# EAGLE design Arduino_8FSR (EAGLE 9.5.2)
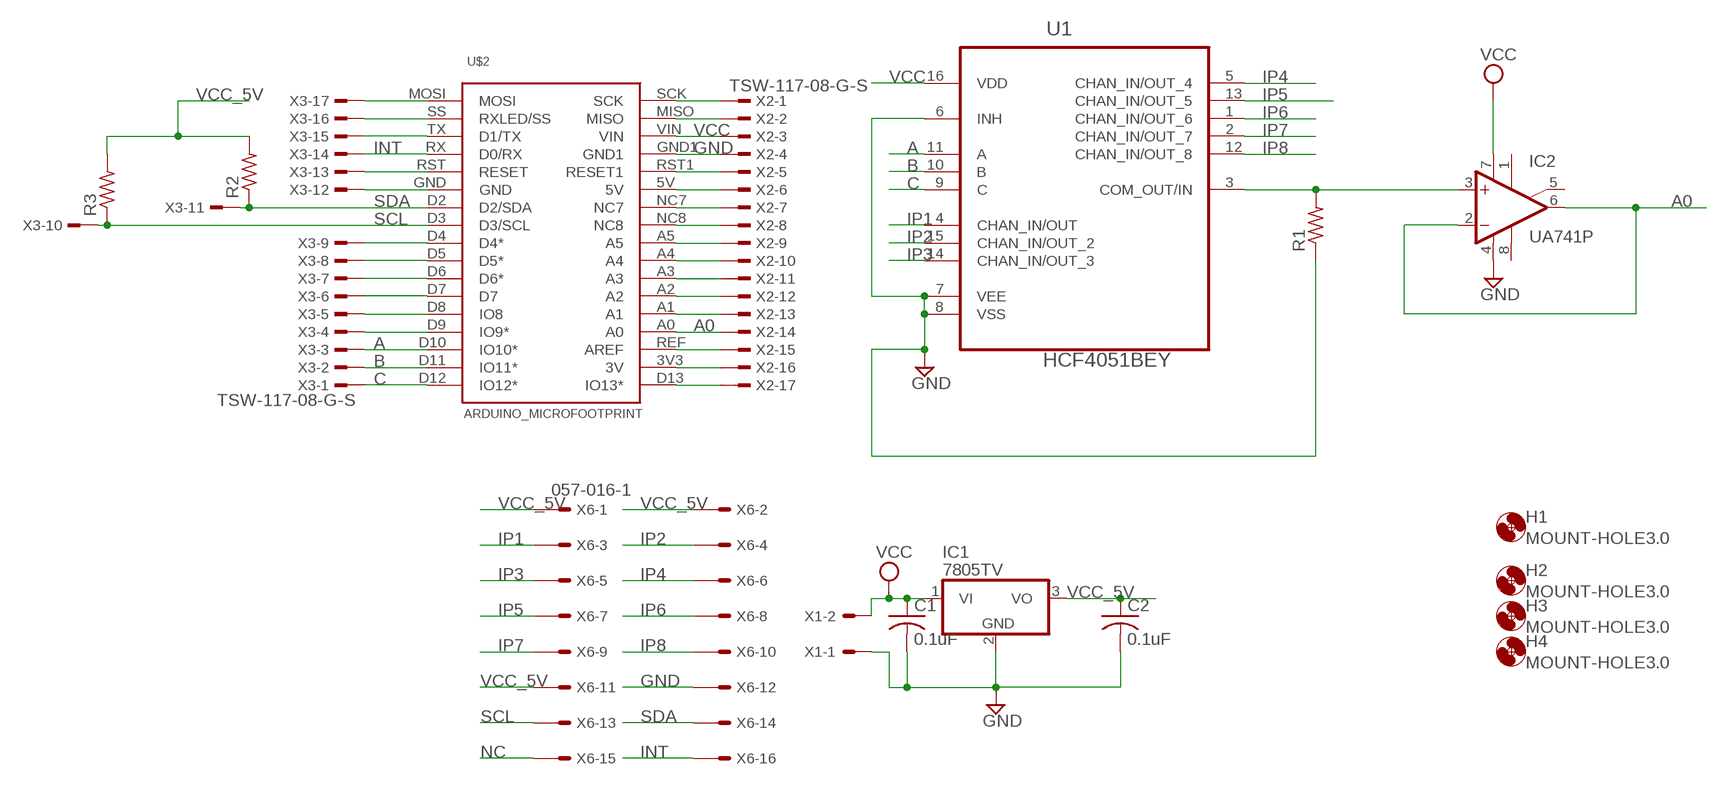
[diagram p0: schematic, sheet 1]

## Parts
C1  0.1uF  C-US025-024X044  [C025-024X044]
C2  0.1uF  C-US025-024X044  [C025-024X044]
H1  MOUNT-HOLE3.0  [3,0]
H2  MOUNT-HOLE3.0  [3,0]
H3  MOUNT-HOLE3.0  [3,0]
H4  MOUNT-HOLE3.0  [3,0]
IC1  7805TV  [TO220V]
IC2  UA741P  [DIL08]
R1  R-US_0204/7  [0204/7]
R2  R-US_0204/7  [0204/7]
R3  R-US_0204/7  [0204/7]
U1  HCF4051BEY  [DIP254P762X510-16]
U$2  ARDUINO_MICROFOOTPRINT  [ARDUINO-MICRO]
X1  KK-156-2  [KK-156-2]
X2  TSW-117-08-G-S  [TSW-117-XX-G-S]
X3  TSW-117-08-G-S  [TSW-117-XX-G-S]
X6  057-016-1  [057-016-1]

## Nets
A: U1.11(A) U$2.D10(IO10*) X3.3
A0: IC2.2(-IN) IC2.6(OUT) U$2.A0 X2.14
B: U1.10(B) U$2.D11(IO11*) X3.2
C: U1.9(C) U$2.D12(IO12*) X3.1
GND: C1.2 C2.2 IC1.2(GND) IC2.4(V-) R1.1 U1.6(INH) U1.7(VEE) U1.8(VSS) U$2.GND1 X1.1 X2.4 X6.12
INT: U$2.RX(D0/RX) X3.14 X6.16
IP1: U1.4(CHAN_IN/OUT) X6.3
IP2: U1.15(CHAN_IN/OUT_2) X6.4
IP3: U1.14(CHAN_IN/OUT_3) X6.5
IP4: U1.5(CHAN_IN/OUT_4) X6.6
IP5: U1.13(CHAN_IN/OUT_5) X6.7
IP6: U1.1(CHAN_IN/OUT_6) X6.8
IP7: U1.2(CHAN_IN/OUT_7) X6.9
IP8: U1.12(CHAN_IN/OUT_8) X6.10
N$1: U$2.MOSI X3.17
N$2: U$2.SS(RXLED/SS) X3.16
N$3: U$2.D13(IO13*) X2.17
N$4: U$2.D5(D5*) X3.8
N$5: U$2.RST(RESET) X3.13
N$6: U$2.GND X3.12
N$7: U$2.D6(D6*) X3.7
N$8: U$2.D7 X3.6
N$9: U$2.D4(D4*) X3.9
N$10: U$2.TX(D1/TX) X3.15
N$13: U$2.D8(IO8) X3.5
N$14: U$2.D9(IO9*) X3.4
N$19: U$2.3V3(3V) X2.16
N$20: U$2.REF(AREF) X2.15
N$22: U$2.A1 X2.13
N$23: U$2.A2 X2.12
N$24: U$2.A3 X2.11
N$25: U$2.A4 X2.10
N$26: U$2.A5 X2.9
N$27: U$2.NC8 X2.8
N$28: U$2.NC7 X2.7
N$29: U$2.5V X2.6
N$30: U$2.RST1(RESET1) X2.5
N$33: U$2.MISO X2.2
N$34: U$2.SCK X2.1
N$48: IC2.3(+IN) R1.2 U1.3(COM_OUT/IN)
NC: X6.15
SCL: R3.1 U$2.D3(D3/SCL) X3.10 X6.13
SDA: R2.1 U$2.D2(D2/SDA) X3.11 X6.14
VCC: C1.1 IC1.1(VI) IC2.7(V+) U1.16(VDD) U$2.VIN X1.2 X2.3
VCC_5V: C2.1 IC1.3(VO) R2.2 R3.2 X6.1 X6.2 X6.11
Unconnected: IC2.1(ON1) IC2.5(ON2) IC2.8(OPT)

## Library data of the parts
C1 C2 = rcl:C-US: CAPACITOR, American symbol; SPICEPREFIX: C
H1-H4 = holes:MOUNT-HOLE: MOUNTING HOLE with drill center marker
IC1 = linear:78*: Positive VOLTAGE REGULATOR Source: http://cache.national.com/ds/LM/LM78L05.pdf http://www.fairchildsemi.com/ds/LM/LM7805.pdf
IC2 = linear:*741: OP AMP
R1-R3 = rcl:R-US_: RESISTOR, American symbol; SPICEPREFIX: R
U1 = HCF4051BEY:HCF4051BEY: ANALOG MULTIPLEXER/DEMULTIPLEXER; AVAILABILITY: Unavailable; DESCRIPTION: 1 Circuit IC Switch 8:1 280Ohm 16-PDIP; MF: STMicroelectronics; MP: HCF4051BEY; PACKAGE: DIP-16 STMicroelectronics; PRICE: None
U$2 = arduino-micro:ARDUINO_MICRO
X1 = con-molex:KK-156-2: KK 156 HEADER Source: http://www.molex.com/pdm_docs/sd/026604100_sd.pdf; MF: MOLEX; OC_FARNELL: unknown; OC_NEWARK: unknown
X2 X3 = con-samtec:TSW-117-*-G-S: THROUGH-HOLE .025" SQ POST HEADER Source: Samtec TSW.pdf; MF: Samtec Inc.; MPN: TSW-117-07-G-S
X6 = con-panduit:057-016-: CONNECTOR 10-pin series 057 contact pc board low profile headers; OC_FARNELL: unknown; OC_NEWARK: unknown

## Board
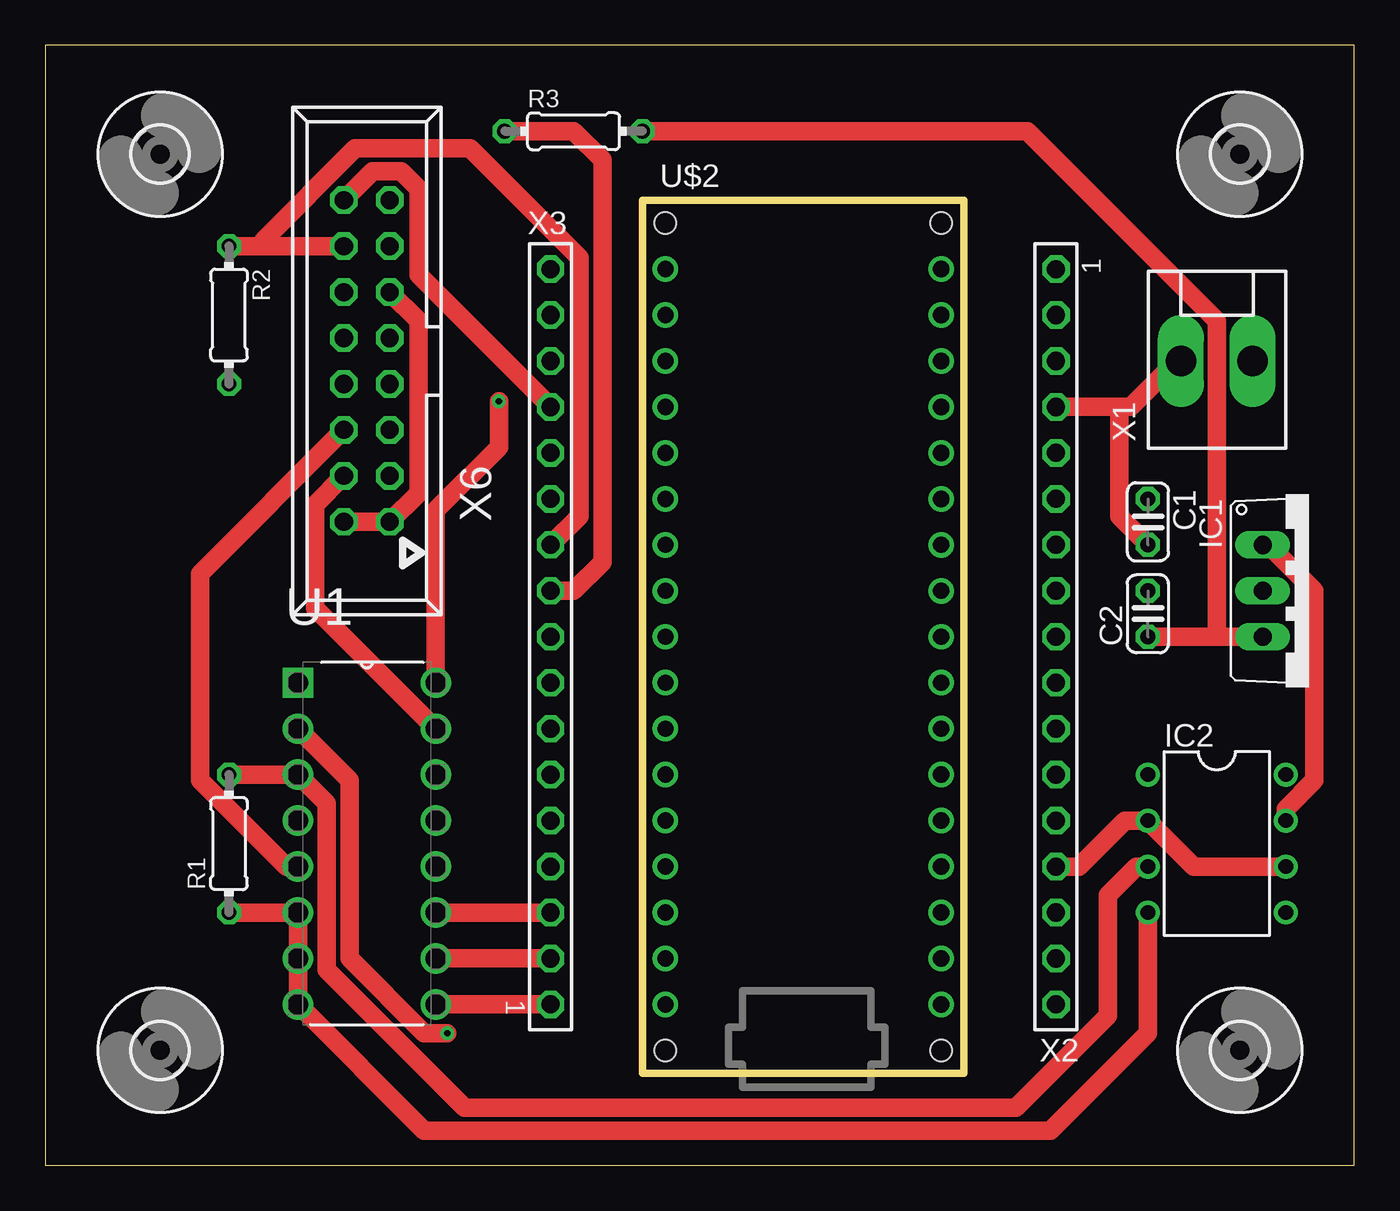
[diagram p1: board, top side]
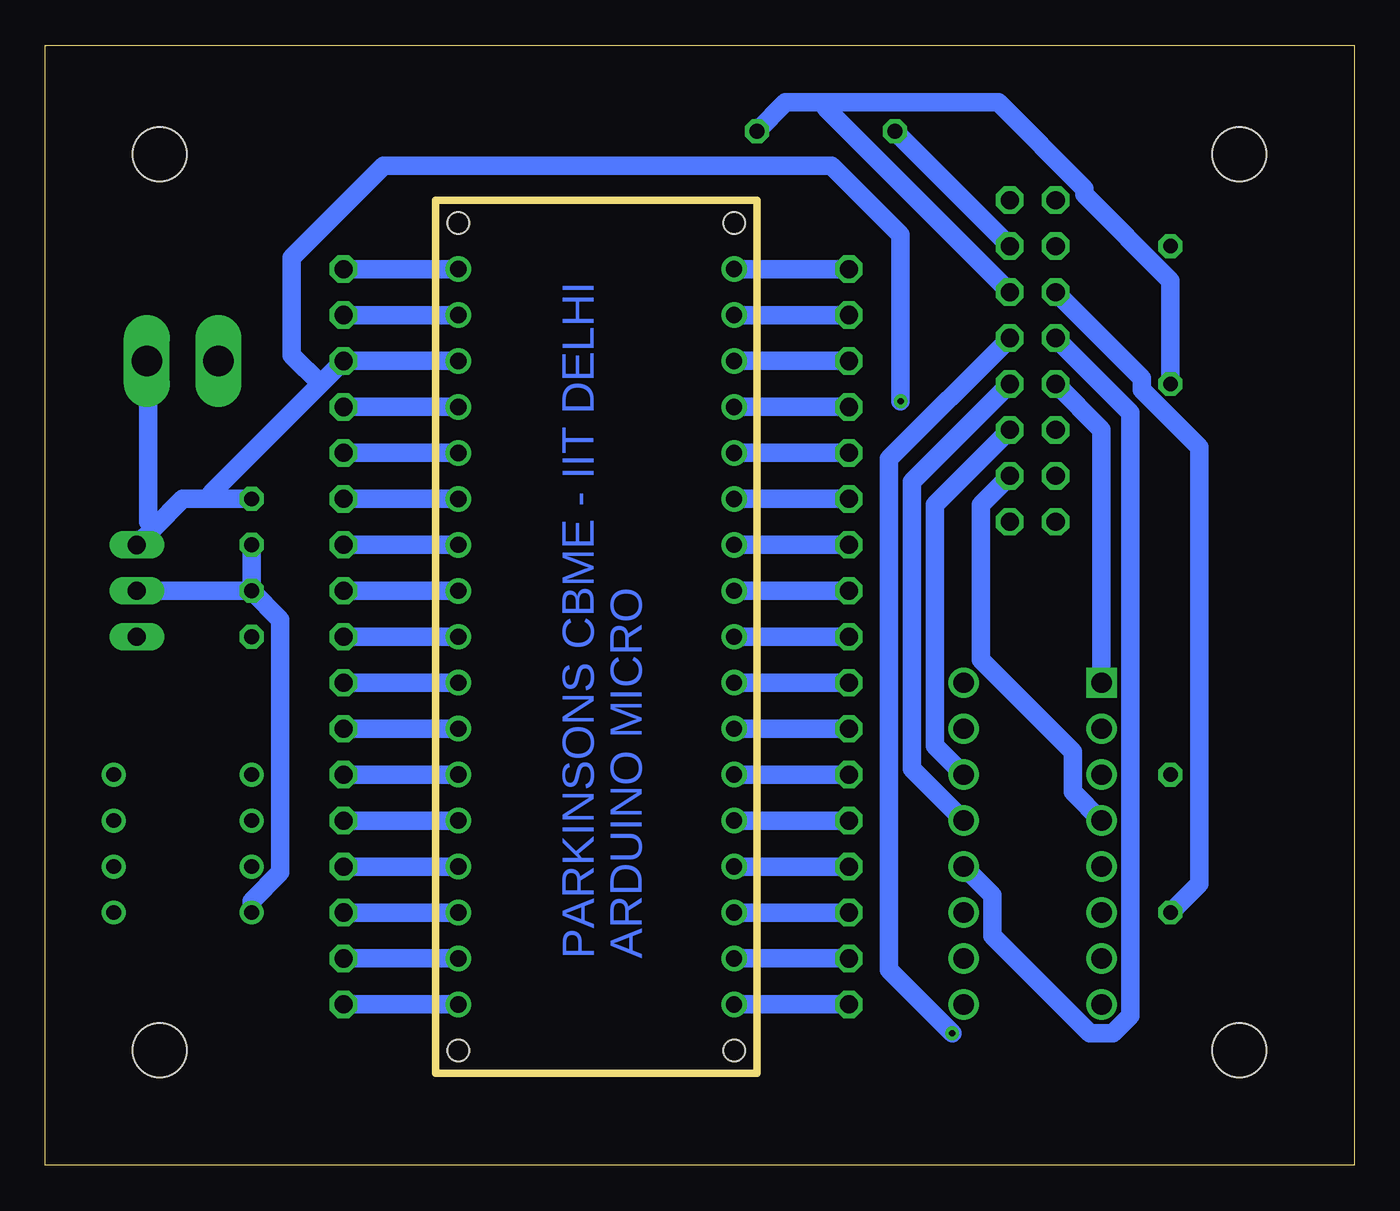
[diagram p2: board, bottom side, seen from below]

Size 72.37 x 61.9 mm. Coordinates in mm from the lower left corner, seen from the top.
Outline: 0,0 72.37,0 72.37,61.9 0,61.9 0,0
Copper layers (1*16): Top 0.035mm / dielectric 1.5mm / Bottom 0.035mm
Design rules "default *": minimum track width 40mil, minimum drill 0.35mm, track to track 6mil, track to pad 6mil, pad to pad 6mil, via to via 6mil, smd to smd 6mil, copper to edge 40mil, drill to drill 6mil, minimum pad ring 10mil, minimum via ring 8mil, stop-mask expansion 4mil, vias tented up to drill 0mil, thermal gap 10mil

### Footprints (pad centres in the part's own frame; a part is rotated, then mirrored left to right if it is on the bottom)
C025-024X044 = drill 0.813 octagon: 1 -1.27,0; 2 1.27,0
3,0 = hole 3: 0,0
TO220V = drill 1.016 long: 1 -2.54,-2.54; 2 0,-2.54; 3 2.54,-2.54
DIL08 = drill 0.813 pad 1.27: 1 -3.81,-3.81; 2 -1.27,-3.81; 3 1.27,-3.81; 4 3.81,-3.81; 5 3.81,3.81; 6 1.27,3.81; 7 -1.27,3.81; 8 -3.81,3.81
0204/7 = drill 0.813 octagon: 1 -3.81,0; 2 3.81,0
DIP254P762X510-16 = drill 1.118 square: 1 -7.62,17.78 | drill 1.118: 2 -7.62,15.24; 3 -7.62,12.7; 4 -7.62,10.16; 5 -7.62,7.62; 6 -7.62,5.08; 7 -7.62,2.54; 8 -7.62,0; 9 0,0; 10 0,2.54; 11 0,5.08; 12 0,7.62; 13 0,10.16; 14 0,12.7; 15 0,15.24; 16 0,17.78
ARDUINO-MICRO = drill 0.9: 3V3 16.51,3.81; 5V 16.51,29.21; A0 16.51,8.89; A1 16.51,11.43; A2 16.51,13.97; A3 16.51,16.51; A4 16.51,19.05; A5 16.51,21.59; D2 1.27,26.67; D3 1.27,24.13; D4 1.27,21.59; D5 1.27,19.05; D6 1.27,16.51; D7 1.27,13.97; D8 1.27,11.43; D9 1.27,8.89; D10 1.27,6.35; D11 1.27,3.81; D12 1.27,1.27; D13 16.51,1.27; GND 1.27,29.21; GND1 16.51,34.29; MISO 16.51,39.37; MOSI 1.27,41.91; NC7 16.51,26.67; NC8 16.51,24.13; REF 16.51,6.35; RST 1.27,31.75; RST1 16.51,31.75; RX 1.27,34.29; SCK 16.51,41.91; SS 1.27,39.37; TX 1.27,36.83; VIN 16.51,36.83 | hole 1.2: 1.27,-1.27; 16.51,-1.27; 1.27,44.45; 16.51,44.45
KK-156-2 = drill 1.7 pad 2.184 long: 1 -1.98,0; 2 1.98,0
TSW-117-XX-G-S = drill 1 pad 1.5 octagon: 1 20.32,0; 2 17.78,0; 3 15.24,0; 4 12.7,0; 5 10.16,0; 6 7.62,0; 7 5.08,0; 8 2.54,0; 9 0,0; 10 -2.54,0; 11 -5.08,0; 12 -7.62,0; 13 -10.16,0; 14 -12.7,0; 15 -15.24,0; 16 -17.78,0; 17 -20.32,0
057-016-1 = drill 1 octagon: 1 -8.89,-1.27; 2 -8.89,1.27; 3 -6.35,-1.27; 4 -6.35,1.27; 5 -3.81,-1.27; 6 -3.81,1.27; 7 -1.27,-1.27; 8 -1.27,1.27; 9 1.27,-1.27; 10 1.27,1.27; 11 3.81,-1.27; 12 3.81,1.27; 13 6.35,-1.27; 14 6.35,1.27; 15 8.89,-1.27; 16 8.89,1.27

### Placement (x,y rotation side)
C1  60.96,35.56 270 top
C2  60.96,30.48 90 top
H1  6.35,6.35 0 top
H2  6.35,55.88 0 top
H3  66.04,55.88 0 top
H4  66.04,6.35 0 top
IC1  69.85,31.75 270 top
IC2  64.77,17.78 270 top
R1  10.16,17.78 90 top
R2  10.16,46.99 270 top
R3  29.21,57.15 0 top
U1  21.59,8.89 0 top
U$2  33.02,7.62 0 top
X1  64.77,44.45 0 top
X2  55.88,29.21 90 top
X3  27.94,29.21 270 top
X6  17.78,44.45 90 top

### Tracks (layer width: path | path; a pad name or v marks a point on that pad's centre or on a via)
A
  Top 1.016: U1.11 X3.3
  Bottom 1.016: U$2.D10 X3.3
A0
  Top 1.016: X2.14 57.15,16.51 59.69,19.05 IC2.2 63.5,16.51 IC2.6
  Bottom 1.016: U$2.A0 X2.14
B
  Top 1.016: U1.10 X3.2
  Bottom 1.016: U$2.D11 X3.2
C
  Top 1.016: U1.9 X3.1
  Bottom 1.016: U$2.D12 X3.1
GND
  Top 1.016: 59.37,41.91 60.01,41.91 62.55,44.45 X1.1 | 59.37,41.91 X2.4 | 59.37,41.91 59.37,35.88 C1.2 | R1.1 U1.6 U1.7 U1.8 20.95,1.91 55.56,1.91 60.96,7.3 IC2.4
  Bottom 1.016: IC2.4 60.96,14.61 59.37,16.19 59.37,30.16 C2.2 | C2.2 C1.2 | C2.2 IC1.2 | X6.12 11.75,43.5 11.75,42.86 8.57,39.69 8.57,15.56 R1.1 | U$2.GND1 X2.4
INT
  Top 1.016: X3.14 20.64,49.21 20.64,53.98 19.68,54.93 18.1,54.93 X6.16
  Bottom 1.016: U$2.RX X3.14
IP1
  Bottom 1.016: X6.3 20.64,36.51 20.64,27.94 15.56,22.86 15.56,20.64 U1.4
IP2
  Top 1.016: X6.4 14.92,36.51 14.92,30.8 U1.15
IP3
  Bottom 1.016: X6.5 23.18,36.51 23.18,23.18 U1.14
IP4
  Top 1.016: X6.6 8.57,32.7 8.57,21.27 13.34,16.51 U1.5
IP5
  Bottom 1.016: X6.7 24.45,37.78 24.45,21.91 U1.13
IP6
  Bottom 1.016: X6.8 13.97,40.64 U1.1
IP7  (via drill 0.35)
  Top 1.016: v22.23,7.3 20.95,7.3 16.83,11.43 16.83,21.27 U1.2
  Bottom 1.016: X6.9 25.72,39.05 25.72,10.79 v22.23,7.3
IP8
  Bottom 1.016: X6.10 12.38,41.59 12.38,8.26 13.34,7.3 14.61,7.3 20,12.7 20,14.92 U1.12
N$1
  Bottom 1.016: U$2.MOSI X3.17
N$2
  Bottom 1.016: U$2.SS X3.16
N$3
  Bottom 1.016: U$2.D13 X2.17
N$4
  Bottom 1.016: U$2.D5 X3.8
N$5
  Bottom 1.016: U$2.RST X3.13
N$6
  Bottom 1.016: U$2.GND X3.12
N$7
  Bottom 1.016: U$2.D6 X3.7
N$8
  Bottom 1.016: U$2.D7 X3.6
N$9
  Bottom 1.016: U$2.D4 X3.9
N$10
  Bottom 1.016: U$2.TX X3.15
N$13
  Bottom 1.016: U$2.D8 X3.5
N$14
  Bottom 1.016: U$2.D9 X3.4
N$19
  Bottom 1.016: U$2.3V3 X2.16
N$20
  Bottom 1.016: U$2.REF X2.15
N$22
  Bottom 1.016: U$2.A1 X2.13
N$23
  Bottom 1.016: U$2.A2 X2.12
N$24
  Bottom 1.016: U$2.A3 X2.11
N$25
  Bottom 1.016: U$2.A4 X2.10
N$26
  Bottom 1.016: U$2.A5 X2.9
N$27
  Bottom 1.016: U$2.NC8 X2.8
N$28
  Bottom 1.016: U$2.NC7 X2.7
N$29
  Bottom 1.016: U$2.5V X2.6
N$30
  Bottom 1.016: U$2.RST1 X2.5
N$33
  Bottom 1.016: U$2.MISO X2.2
N$34
  Bottom 1.016: U$2.SCK X2.1
N$48
  Top 1.016: R1.2 U1.3 15.56,20 15.56,10.79 23.18,3.17 53.66,3.17 58.74,8.26 58.74,14.92 60.33,16.51 IC2.3
SCL
  Top 1.016: X3.10 29.21,31.75 30.8,33.34 30.8,55.56 29.21,57.15 R3.1
  Bottom 1.016: X6.13 R3.1 | U$2.D3 X3.10
SDA
  Top 1.016: X6.14 12.06,50.8 | 12.06,50.8 R2.1 | X3.11 29.53,35.88 29.53,50.16 23.5,56.2 17.14,56.2 12.06,51.12 12.06,50.8
  Bottom 1.016: U$2.D2 X3.11
VCC  (via drill 0.35)
  Top 1.016: IC2.7 68.58,19.68 70.17,21.27 70.17,31.75 67.63,34.29 IC1.1 | U1.16 21.59,36.2 25.08,39.69 v25.08,42.23
  Bottom 1.016: 63.18,36.83 64.77,36.83 66.36,35.24 | 63.18,36.83 C1.1 | IC1.1 66.36,35.24 | 57.15,43.18 63.18,37.15 63.18,36.83 | 57.15,43.18 X2.3 U$2.VIN | v25.08,42.23 25.08,51.44 28.89,55.24 53.66,55.24 58.74,50.16 58.74,44.77 57.15,43.18 | X1.2 66.67,44.45 66.67,35.56 66.36,35.24
VCC_5V
  Top 1.016: IC1.3 64.77,29.21 | 64.77,29.21 C2.1 | X6.2 X6.1 20.64,37.15 20.64,46.67 X6.11 | 64.77,29.21 64.77,46.67 54.29,57.15 R3.2
  Bottom 1.016: R2.2 10.16,48.9 14.92,53.66 14.92,53.98 19.68,58.74 29.21,58.74 | 29.21,58.74 31.43,58.74 R3.2 | X6.11 29.21,58.42 29.21,58.74

### Text on the board
Bottom: PARKINSONS CBME - IIT DELHI / ARDUINO MICRO